# EAGLE schematic LinuxBoard_v1.0 (EAGLE 7.1.0)
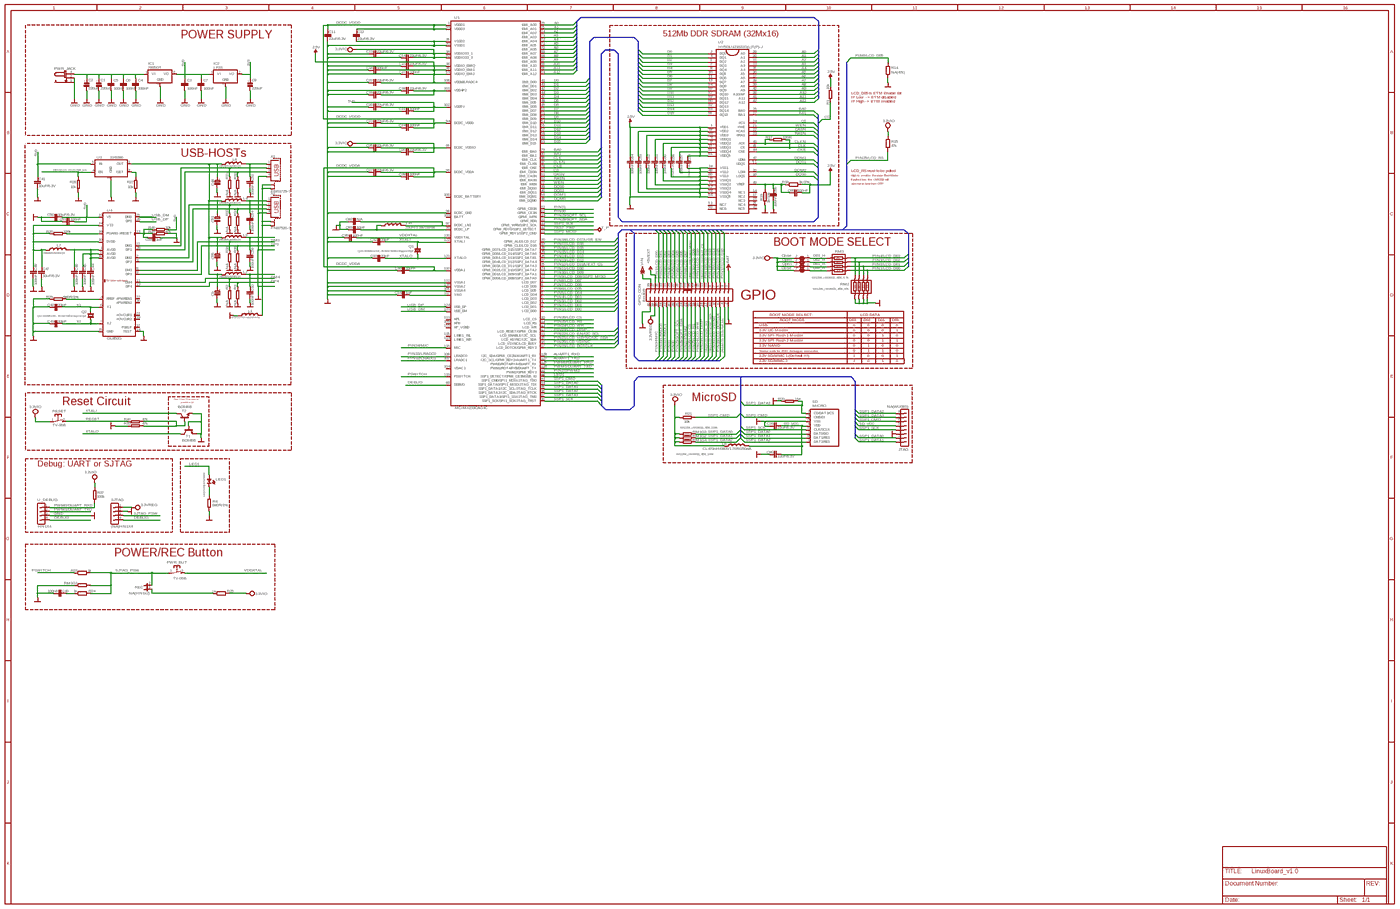
[diagram p0: schematic, sheet 1, overview]
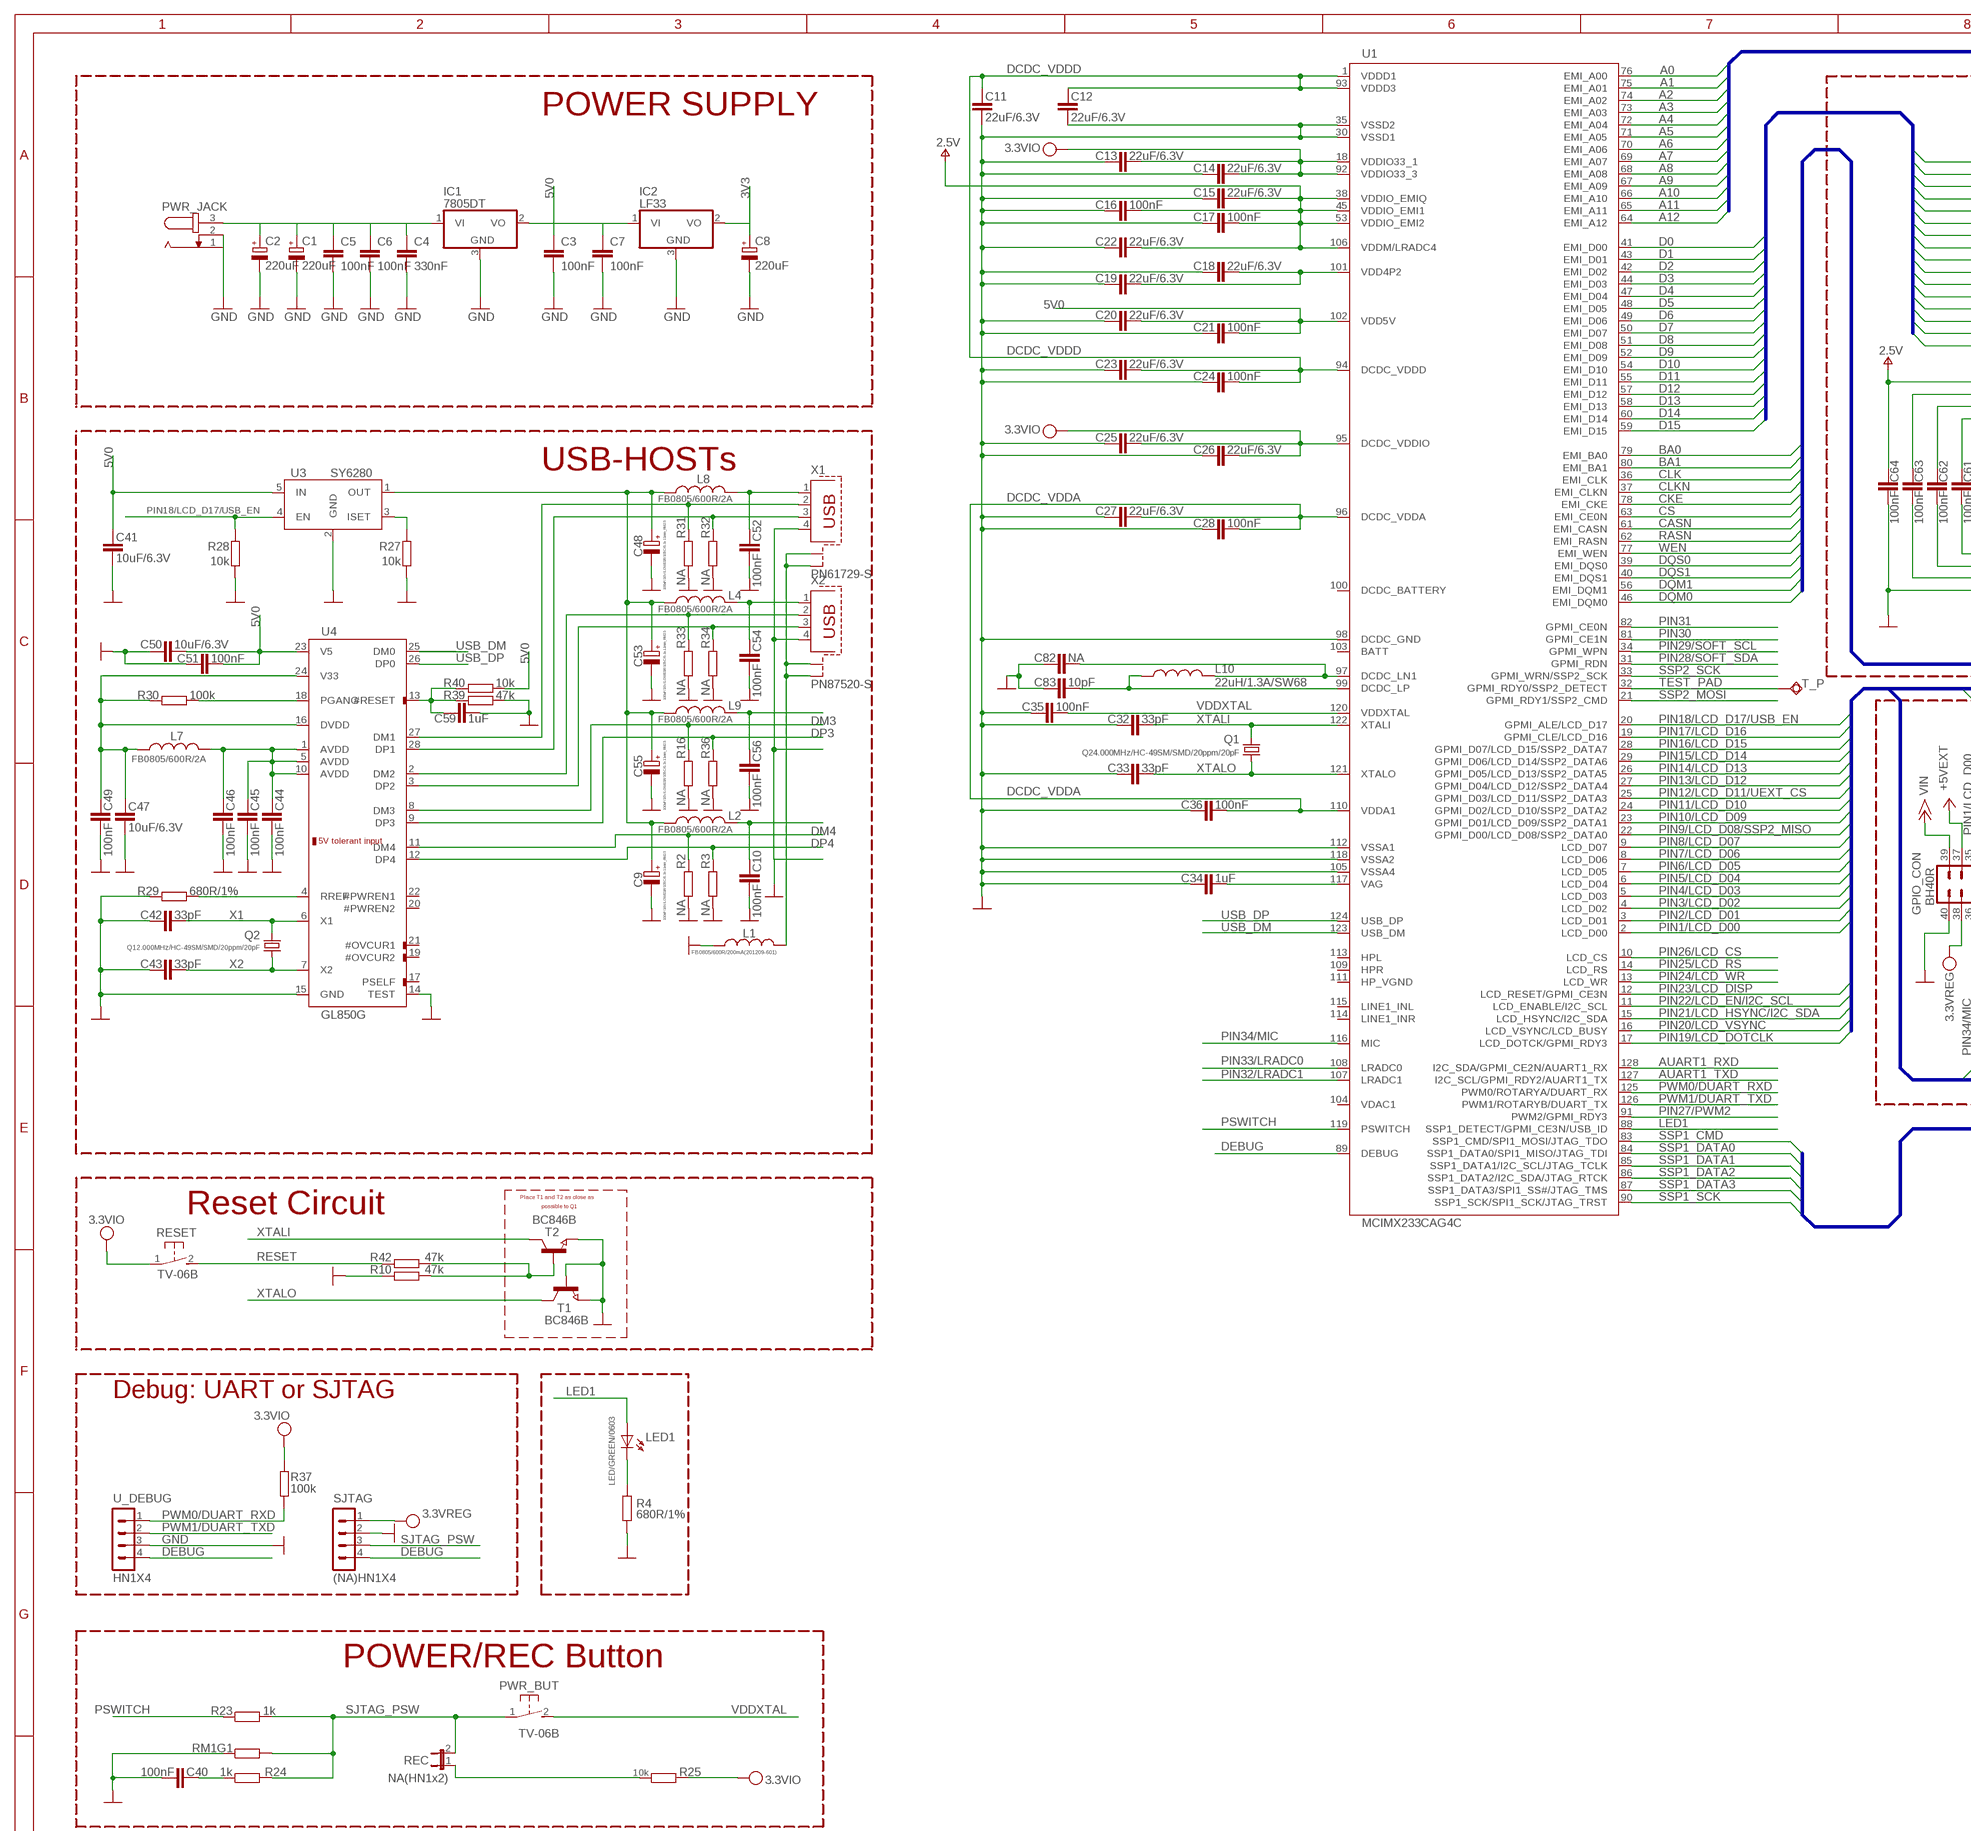
[diagram p1: schematic, sheet 1, part 1 of 4]
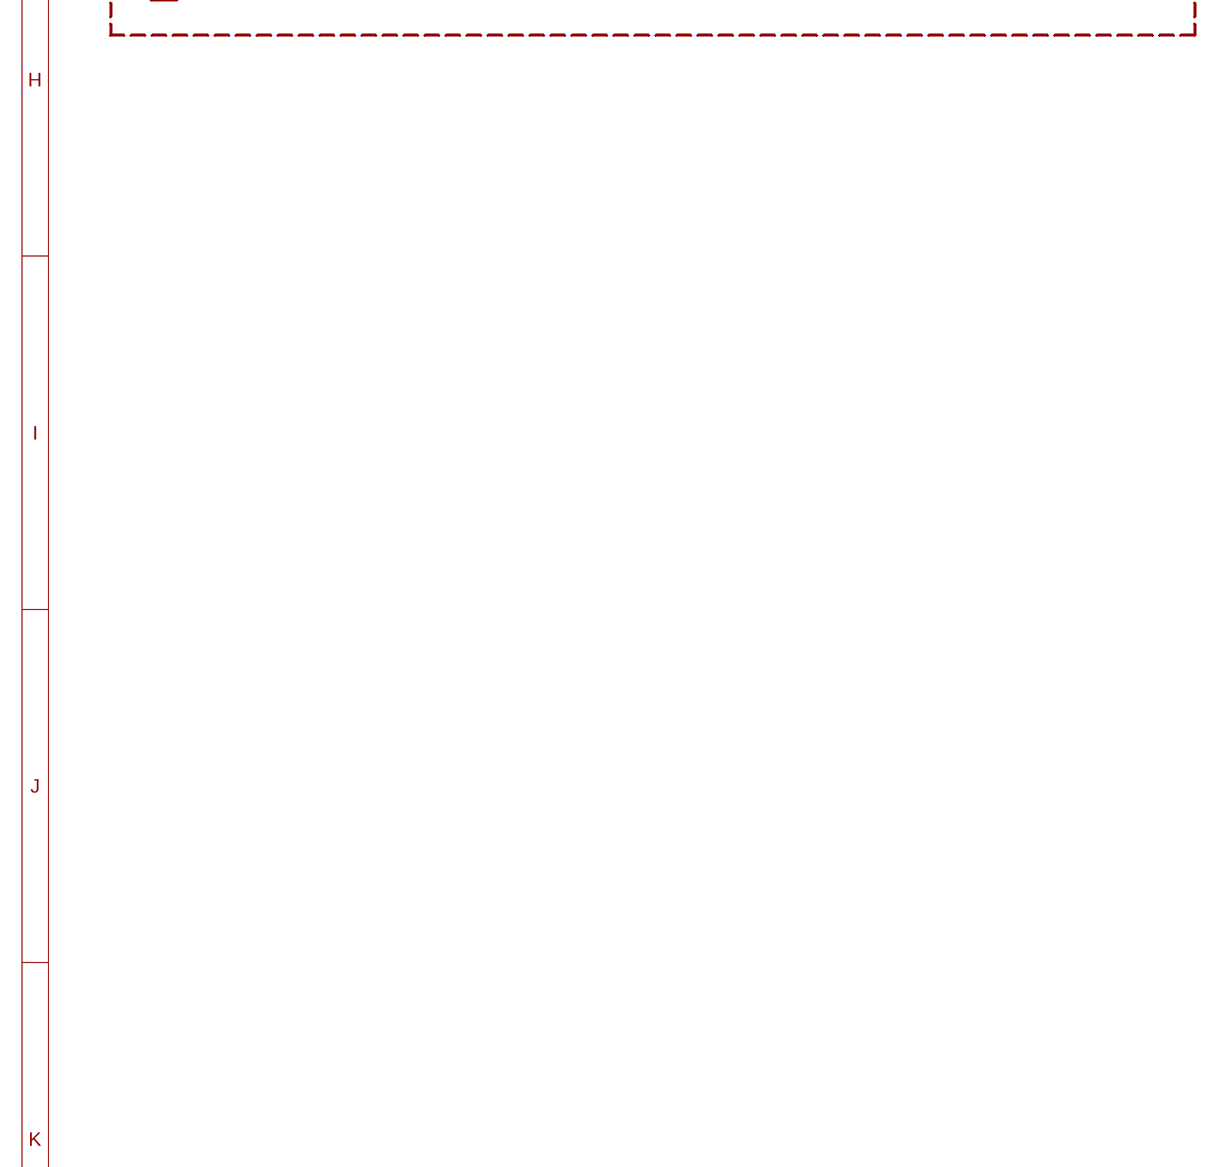
[diagram p2: schematic, sheet 1, part 2 of 4]
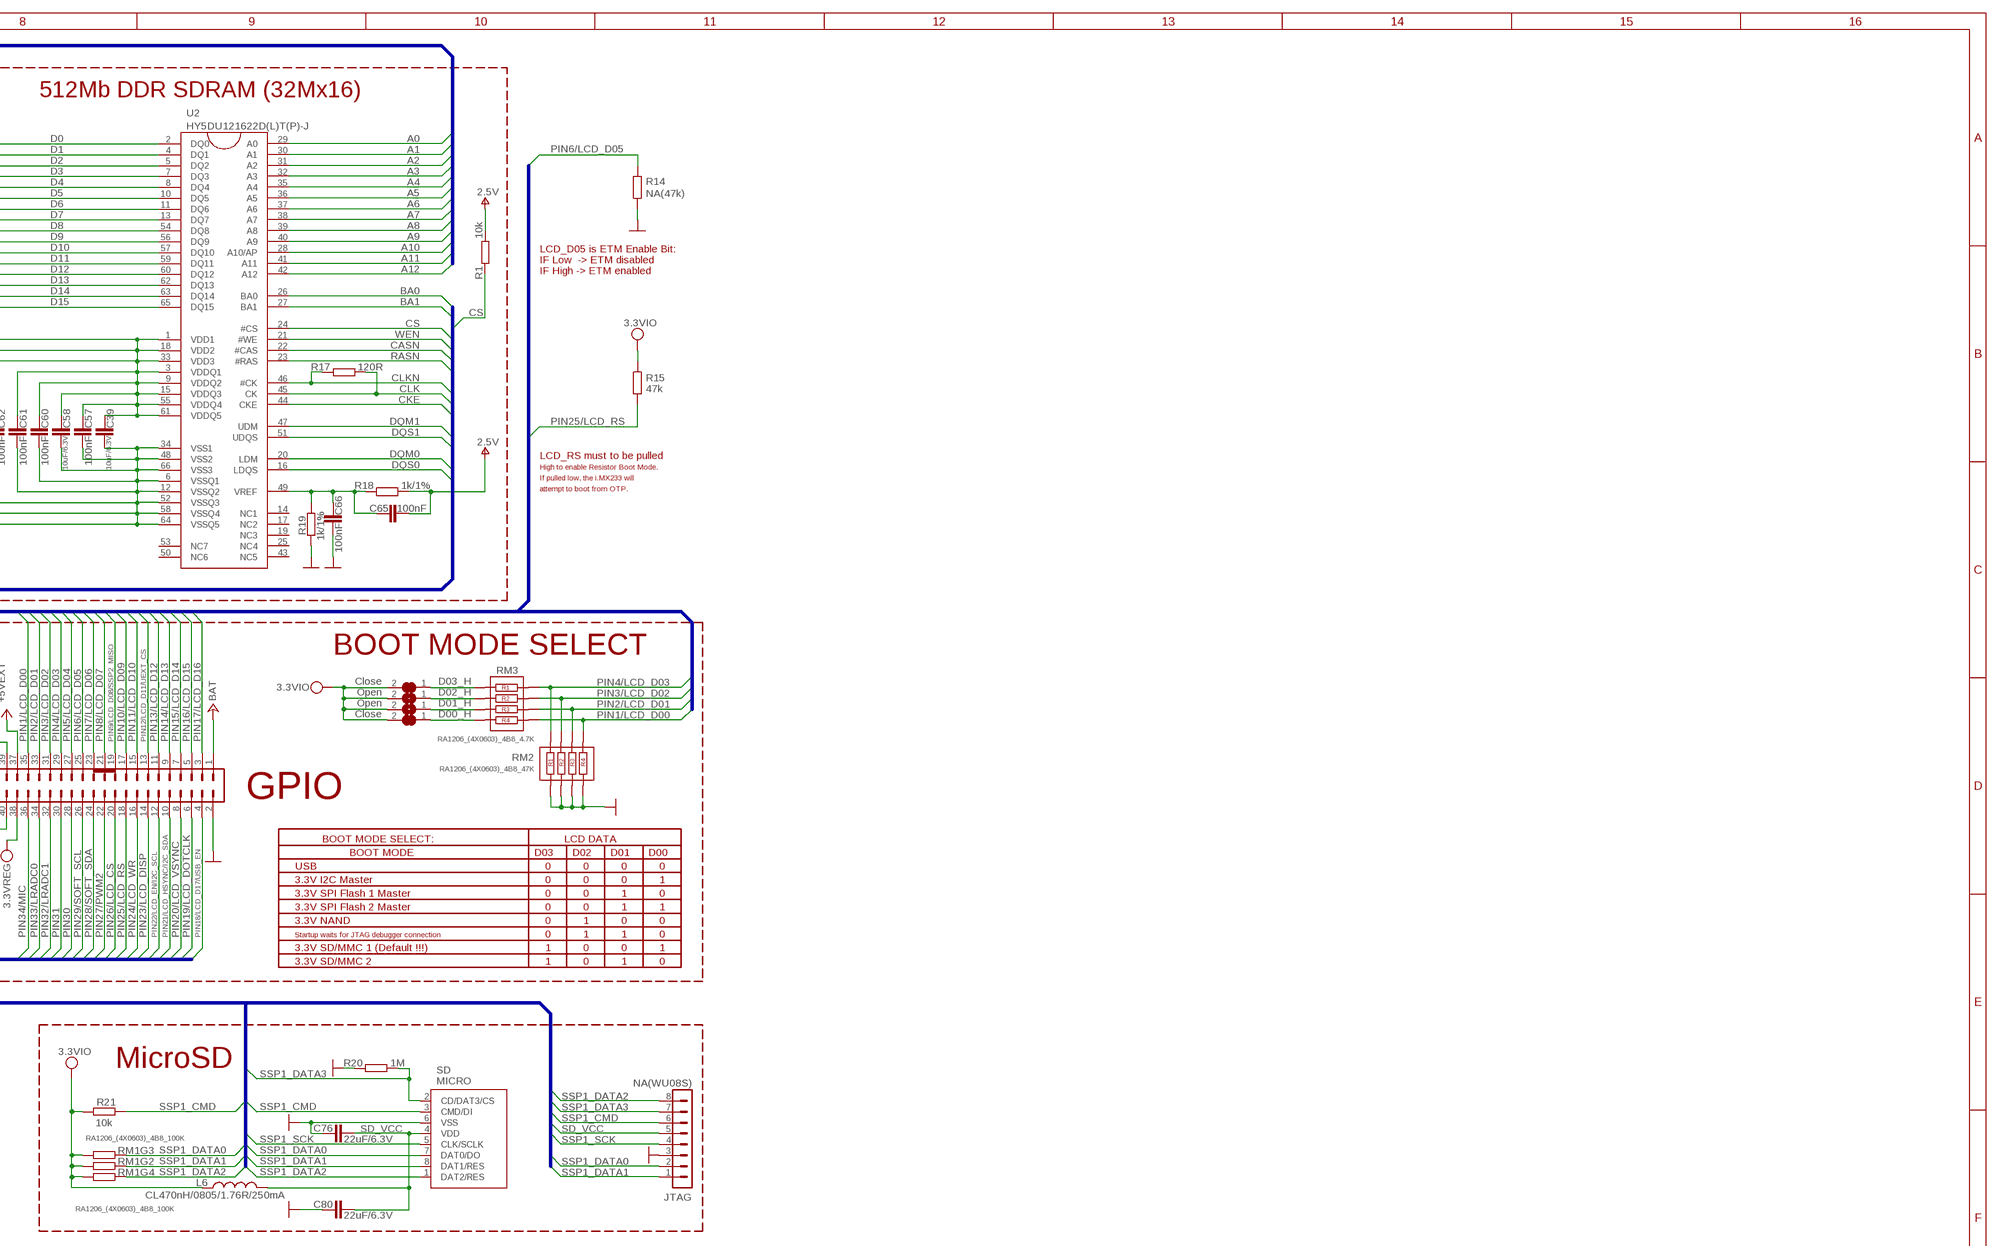
[diagram p3: schematic, sheet 1, part 3 of 4]
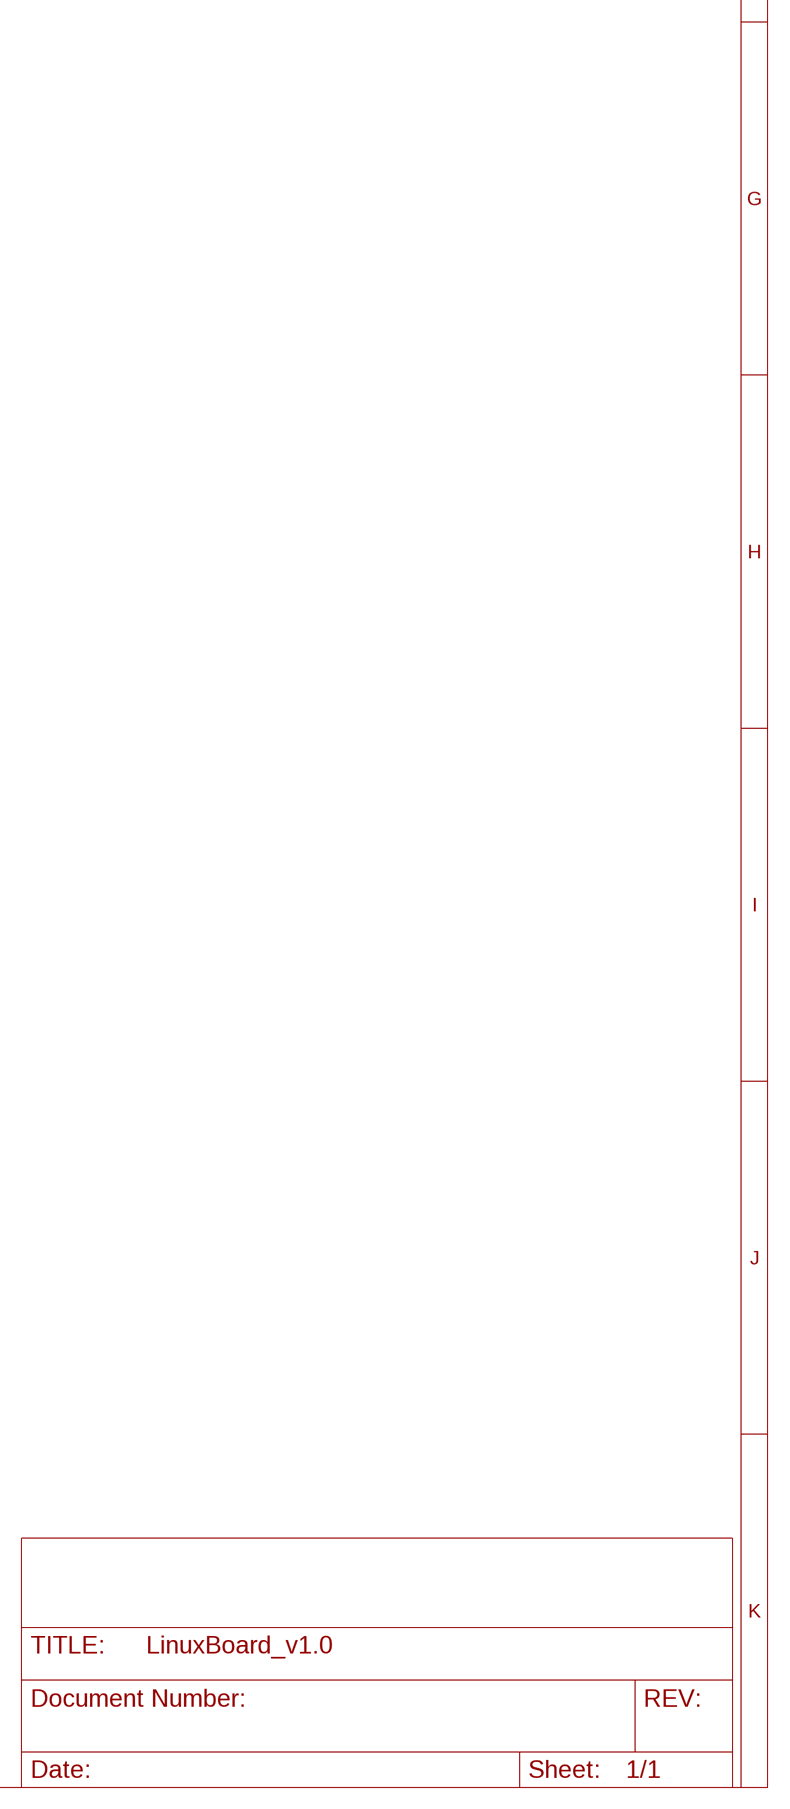
[diagram p4: schematic, sheet 1, part 4 of 4]

## Parts
C1  220uF  CPOL-EUE2-5  [E2-5]
C2  220uF  CPOL-EUE2-5  [E2-5]
C3  100nF  C-EUC0805  [C0805]
C4  330nF  C-EUC0805  [C0805]
C5  100nF  C-EUC0805  [C0805]
C6  100nF  C-EUC0805  [C0805]
C7  100nF  C-EUC0805  [C0805]
C8  220uF  CPOL-EUE2-5  [E2-5]
C9  100uF/16V/LOWESR/105C/6.3x11mm_RM2.5  CPOL-EUE2.5-6.3  [E2,5-6,3]
C10  100nF  C-EUC0603_DWS  [C0603_DWS]
C11  22uF/6.3V  C-EUC0805_5MIL_DWS  [C0805_5MIL_DWS]
C12  22uF/6.3V  C-EUC0805_5MIL_DWS  [C0805_5MIL_DWS]
C13  22uF/6.3V  C-EUC0805_5MIL_DWS  [C0805_5MIL_DWS]
C14  22uF/6.3V  C-EUC0805_5MIL_DWS  [C0805_5MIL_DWS]
C15  22uF/6.3V  C-EUC0805_5MIL_DWS  [C0805_5MIL_DWS]
C16  100nF  C-EUC0603_DWS  [C0603_DWS]
C17  100nF  C-EUC0603_DWS  [C0603_DWS]
C18  22uF/6.3V  C-EUC0805_5MIL_DWS  [C0805_5MIL_DWS]
C19  22uF/6.3V  C-EUC0805_5MIL_DWS  [C0805_5MIL_DWS]
C20  22uF/6.3V  C-EUC0805_5MIL_DWS  [C0805_5MIL_DWS]
C21  100nF  C-EUC0603_DWS  [C0603_DWS]
C22  22uF/6.3V  C-EUC0805_5MIL_DWS  [C0805_5MIL_DWS]
C23  22uF/6.3V  C-EUC0805_5MIL_DWS  [C0805_5MIL_DWS]
C24  100nF  C-EUC0603_DWS  [C0603_DWS]
C25  22uF/6.3V  C-EUC0805_5MIL_DWS  [C0805_5MIL_DWS]
C26  22uF/6.3V  C-EUC0805_5MIL_DWS  [C0805_5MIL_DWS]
C27  22uF/6.3V  C-EUC0805_5MIL_DWS  [C0805_5MIL_DWS]
C28  100nF  C-EUC0603_DWS  [C0603_DWS]
C32  33pF  C-EUC0603_DWS  [C0603_DWS]
C33  33pF  C-EUC0603_DWS  [C0603_DWS]
C34  1uF  C-EUC0603_DWS  [C0603_DWS]
C35  100nF  C-EUC0603_DWS  [C0603_DWS]
C36  100nF  C-EUC0603_DWS  [C0603_DWS]
C39  10uF/6.3V  C-EUC0603_DWS  [C0603_DWS]
C40  100nF  C-EUC0603_DWS  [C0603_DWS]
C41  10uF/6.3V  C-EUC0603_DWS  [C0603_DWS]
C42  33pF  C-EUC0603_DWS  [C0603_DWS]
C43  33pF  C-EUC0603_DWS  [C0603_DWS]
C44  100nF  C-EUC0603_DWS  [C0603_DWS]
C45  100nF  C-EUC0603_DWS  [C0603_DWS]
C46  100nF  C-EUC0603_DWS  [C0603_DWS]
C47  10uF/6.3V  C-EUC0603_DWS  [C0603_DWS]
C48  100uF/16V/LOWESR/105C/6.3x11mm_RM2.5  CPOL-EUE2.5-6.3  [E2,5-6,3]
C49  100nF  C-EUC0603_DWS  [C0603_DWS]
C50  10uF/6.3V  C-EUC0603_DWS  [C0603_DWS]
C51  100nF  C-EUC0603_DWS  [C0603_DWS]
C52  100nF  C-EUC0603_DWS  [C0603_DWS]
C53  100uF/16V/LOWESR/105C/6.3x11mm_RM2.5  CPOL-EUE2.5-6.3  [E2,5-6,3]
C54  100nF  C-EUC0603_DWS  [C0603_DWS]
C55  100uF/16V/LOWESR/105C/6.3x11mm_RM2.5  CPOL-EUE2.5-6.3  [E2,5-6,3]
C56  100nF  C-EUC0603_DWS  [C0603_DWS]
C57  100nF  C-EUC0603_DWS  [C0603_DWS]
C58  10uF/6.3V  C-EUC0603_DWS  [C0603_DWS]
C59  1uF  C-EUC0603_DWS  [C0603_DWS]
C60  100nF  C-EUC0603_DWS  [C0603_DWS]
C61  100nF  C-EUC0603_DWS  [C0603_DWS]
C62  100nF  C-EUC0603_DWS  [C0603_DWS]
C63  100nF  C-EUC0603_DWS  [C0603_DWS]
C64  100nF  C-EUC0603_DWS  [C0603_DWS]
C65  100nF  C-EUC0603_DWS  [C0603_DWS]
C66  100nF  C-EUC0603_DWS  [C0603_DWS]
C76  22uF/6.3V  C-EUC0805_5MIL_DWS  [C0805_5MIL_DWS]
C80  22uF/6.3V  C-EUC0805_5MIL_DWS  [C0805_5MIL_DWS]
C82  NA  C-EUC0603_DWS  [C0603_DWS]
C83  10pF  C-EUC0603_DWS  [C0603_DWS]
D00_H  Close  SJSJ_SMALLER  [SJ_1_SMALLER]
D01_H  Open  SJSJ_SMALLER  [SJ_1_SMALLER]
D02_H  Open  SJSJ_SMALLER  [SJ_1_SMALLER]
D03_H  Close  SJSJ_SMALLER  [SJ_1_SMALLER]
GPIO_CON  BH40R  ML40R  [BH40R]
IC1  7805DT  [TO252]
IC2  LF33  7805DT  [TO252]
JTAG  NA(WU08S)  CON8WU08S  [WU08S]
L1  FB0805/600R/200mA(201209-601)  L-USL0805_5MIL_DWS  [L0805_5MIL_DWS]
L2  FB0805/600R/2A  L-USL0805_5MIL_DWS  [L0805_5MIL_DWS]
L4  FB0805/600R/2A  L-USL0805_5MIL_DWS  [L0805_5MIL_DWS]
L6  CL470nH/0805/1.76R/250mA  L-USL0805_5MIL_DWS  [L0805_5MIL_DWS]
L7  FB0805/600R/2A  L-USL0805_5MIL_DWS  [L0805_5MIL_DWS]
L8  FB0805/600R/2A  L-USL0805_5MIL_DWS  [L0805_5MIL_DWS]
L9  FB0805/600R/2A  L-USL0805_5MIL_DWS  [L0805_5MIL_DWS]
L10  22uH/1.3A/SW68  L-USL_CD53  [CD53]
LED1  LED/GREEN/0603  LED0603DWS  [LED-0603]
PWR_BUT  TV-06B  31-XX  [B3F-31XX]
PWR_JACK  JACK-PLUG0  [SPC4077]
Q1  Q24.000MHz/HC-49SM/SMD/20ppm/20pF  HC49/S1  [HC49/SMD2_THIN]
Q2  Q12.000MHz/HC-49SM/SMD/20ppm/20pF  HC49/S1  [HC49/SMD2_THIN]
R1  10k  R-EU_R0603_5MIL_DWS  [R0603_5MIL_DWS]
R2  NA  R-EU_R0603_5MIL_DWS  [R0603_5MIL_DWS]
R3  NA  R-EU_R0603_5MIL_DWS  [R0603_5MIL_DWS]
R4  680R/1%  R-EU_R0603_5MIL_DWS  [R0603_5MIL_DWS]
R10  47k  R-EU_R0603_5MIL_DWS  [R0603_5MIL_DWS]
R14  NA(47k)  R-EU_R0603_5MIL_DWS  [R0603_5MIL_DWS]
R15  47k  R-EU_R0603_5MIL_DWS  [R0603_5MIL_DWS]
R16  NA  R-EU_R0603_5MIL_DWS  [R0603_5MIL_DWS]
R17  120R  R-EU_R0603_5MIL_DWS  [R0603_5MIL_DWS]
R18  1k/1%  R-EU_R0603_5MIL_DWS  [R0603_5MIL_DWS]
R19  1k/1%  R-EU_R0603_5MIL_DWS  [R0603_5MIL_DWS]
R20  1M  R-EU_R0603_5MIL_DWS  [R0603_5MIL_DWS]
R21  10k  R-EU_R0603_5MIL_DWS  [R0603_5MIL_DWS]
R23  1k  R-EU_R0603_5MIL_DWS  [R0603_5MIL_DWS]
R24  1k  R-EU_R0603_5MIL_DWS  [R0603_5MIL_DWS]
R25  10k  R-EU_R0603_5MIL_DWS_NA  [R0603_5MIL_DWS_NA]
R27  10k  R-EU_R0603_5MIL_DWS  [R0603_5MIL_DWS]
R28  10k  R-EU_R0603_5MIL_DWS  [R0603_5MIL_DWS]
R29  680R/1%  R-EU_R0603_5MIL_DWS  [R0603_5MIL_DWS]
R30  100k  R-EU_R0603_5MIL_DWS  [R0603_5MIL_DWS]
R31  NA  R-EU_R0603_5MIL_DWS  [R0603_5MIL_DWS]
R32  NA  R-EU_R0603_5MIL_DWS  [R0603_5MIL_DWS]
R33  NA  R-EU_R0603_5MIL_DWS  [R0603_5MIL_DWS]
R34  NA  R-EU_R0603_5MIL_DWS  [R0603_5MIL_DWS]
R36  NA  R-EU_R0603_5MIL_DWS  [R0603_5MIL_DWS]
R37  100k  R-EU_R0603_5MIL_DWS  [R0603_5MIL_DWS]
R39  47k  R-EU_R0603_5MIL_DWS  [R0603_5MIL_DWS]
R40  10k  R-EU_R0603_5MIL_DWS  [R0603_5MIL_DWS]
R42  47k  R-EU_R0603_5MIL_DWS  [R0603_5MIL_DWS]
REC  NA(HN1x2)  JP1E  [JP1]
RESET  TV-06B  31-XX  [B3F-31XX]
RM1  RA1206_(4X0603)_4B8_100K  R_MATRIX_4E  [R_MATRIX_4]
RM2  RA1206_(4X0603)_4B8_47K  R_MATRIX_4  [R_MATRIX_4]
RM3  RA1206_(4X0603)_4B8_4.7K  R_MATRIX_4  [R_MATRIX_4]
SD  MICRO  MICRO_SD/MMC  [TFR-MEM-CON]
SJTAG  (NA)HN1X4  CON4HN1X4  [HN1X4]
T1  BC846B  NPN-TRANSISTOR_SOT23  [SOT23]
T2  BC846B  NPN-TRANSISTOR_SOT23  [SOT23]
T_P  TESTPAD50/40  [SMD50/40]
U1  MCIMX233CAG4C  MCIMX233DAG4B_LD  [TQFP128LD]
U2  HY5DU121622D(L)T(P)-J  [66TSOP-II]
U3  SY6280  [SOT23-5]
U4  GL850G  [SSOP28]
U_DEBUG  HN1X4  CON4HN1X4  [HN1X4]
X1  PN61729-S  [PN61729-S]
X2  PN87520-S  [PN87520-S]

## Nets
3V3: C8.+ IC2.2(VO)
5V0: C3.1 C7.1 C20.2 C21.2 C41.1 C50.1 C51.1 IC1.2(VO) IC2.1(VI) R40.2 U1.102(VDD5V) U3.5(IN) U4.23(V5)
+5V: GPIO_CON.37 ; supply symbol labelled +5VEXT
+15V: GPIO_CON.39 ; supply symbol labelled VIN
+24V: GPIO_CON.1 ; supply symbol labelled BAT
A0: U1.76(EMI_A00) U2.29(A0)
A1: U1.75(EMI_A01) U2.30(A1)
A2: U1.74(EMI_A02) U2.31(A2)
A3: U1.73(EMI_A03) U2.32(A3)
A4: U1.72(EMI_A04) U2.35(A4)
A5: U1.71(EMI_A05) U2.36(A5)
A6: U1.70(EMI_A06) U2.37(A6)
A7: U1.69(EMI_A07) U2.38(A7)
A8: U1.68(EMI_A08) U2.39(A8)
A9: U1.67(EMI_A09) U2.40(A9)
A10: U1.66(EMI_A10) U2.28(A10/AP)
A11: U1.65(EMI_A11) U2.41(A11)
A12: U1.64(EMI_A12) U2.42(A12)
AUART1_RXD: U1.128(I2C_SDA/GPMI_CE2N/AUART1_RX)
AUART1_TXD: U1.127(I2C_SCL/GPMI_RDY2/AUART1_TX)
BA0: U1.79(EMI_BA0) U2.26(BA0)
BA1: U1.80(EMI_BA1) U2.27(BA1)
CASN: U1.61(EMI_CASN) U2.22(#CAS)
CKE: U1.78(EMI_CKE) U2.44(CKE)
CLK: R17.2 U1.36(EMI_CLK) U2.45(CK)
CLKN: R17.1 U1.37(EMI_CLKN) U2.46(#CK)
CS: R1.1 U1.63(EMI_CE0N) U2.24(#CS)
D0: U1.41(EMI_D00) U2.2(DQ0)
D1: U1.43(EMI_D01) U2.4(DQ1)
D2: U1.42(EMI_D02) U2.5(DQ2)
D3: U1.44(EMI_D03) U2.7(DQ3)
D4: U1.47(EMI_D04) U2.8(DQ4)
D5: U1.48(EMI_D05) U2.10(DQ5)
D6: U1.49(EMI_D06) U2.11(DQ6)
D7: U1.50(EMI_D07) U2.13(DQ7)
D8: U1.51(EMI_D08) U2.54(DQ8)
D9: U1.52(EMI_D09) U2.56(DQ9)
D10: U1.54(EMI_D10) U2.57(DQ10)
D11: U1.55(EMI_D11) U2.59(DQ11)
D12: U1.57(EMI_D12) U2.60(DQ12)
D13: U1.58(EMI_D13) U2.62(DQ13)
D14: U1.60(EMI_D14) U2.63(DQ14)
D15: U1.59(EMI_D15) U2.65(DQ15)
DCDC_VDDA: C27.2 C28.2 C36.2 U1.96(DCDC_VDDA) U1.110(VDDA1)
DCDC_VDDD: C11.2 C12.2 C23.2 C24.2 U1.1(VDDD1) U1.93(VDDD3) U1.94(DCDC_VDDD)
DEBUG: SJTAG.4 U1.89(DEBUG) U_DEBUG.4
DM3: R16.2 U4.8(DM3)
DM4: R2.2 U4.11(DM4)
DP3: R36.2 U4.9(DP3)
DP4: R3.2 U4.12(DP4)
DQM0: U1.46(EMI_DQM0) U2.20(LDM)
DQM1: U1.56(EMI_DQM1) U2.47(UDM)
DQS0: U1.39(EMI_DQS0) U2.16(LDQS)
DQS1: U1.40(EMI_DQS1) U2.51(UDQS)
GND: C1.- C2.- C3.2 C4.2 C5.2 C6.2 C7.2 C8.- C9.- C10.2 C11.1 C12.1 C13.1 C14.1 C15.1 C16.1 C17.1 C18.1 C19.1 C20.1 C21.1 C22.1 C23.1 C24.1 C25.1 C26.1 C27.1 C28.1 C32.1 C33.1 C34.1 C35.1 C36.1 C39.1 C40.2 C41.2 C42.1 C43.1 C44.2 C45.2 C46.2 C47.2 C48.- C49.2 C50.2 C51.2 C52.2 C53.- C54.2 C55.- C56.2 C57.1 C58.1 C59.1 C60.1 C61.1 C62.1 C63.1 C64.1 C66.1 C76.1 C80.1 C82.1 C83.1 GPIO_CON.2 GPIO_CON.40 IC1.3(GND) IC2.3(GND) JTAG.3 L1.1 PWR_JACK.1 PWR_JACK.2 R2.1 R3.1 R4.1 R10.2 R14.1 R16.1 R19.1 R20.2 R27.1 R28.1 R29.1 R31.1 R32.1 R33.1 R34.1 R36.1 R39.2 RM1.1.1 RM2.1.1 RM2.2.1 RM2.3.1 RM2.4.1 SD.6(VSS) SJTAG.2 T1.1(B) T1.2(E) T2.2(E) U1.30(VSSD1) U1.35(VSSD2) U1.98(DCDC_GND) U1.105(VSSA4) U1.112(VSSA1) U1.118(VSSA2) U2.6(VSSQ1) U2.12(VSSQ2) U2.34(VSS1) U2.48(VSS2) U2.52(VSSQ3) U2.58(VSSQ4) U2.64(VSSQ5) U2.66(VSS3) U3.2(GND) U4.14(TEST) U4.15(GND) U_DEBUG.3 X1.4 X2.4
LED1 [pwr]: LED1.A U1.88(SSP1_DETECT/GPMI_CE3N/USB_ID)
N$1: R27.2 U3.3(ISET)
N$2: R29.2 U4.4(RREF)
N$3: R30.2 U4.18(PGANG)
N$5: C59.2 R39.1 R40.1 U4.13(#RESET)
N$6: C10.1 L2.2
N$7: C9.+ C48.+ C53.+ C55.+ L2.1 L4.1 L8.1 L9.1 U3.1(OUT)
N$9: R31.2 U4.27(DM1) X1.2
N$10: C44.1 C45.1 C46.1 L7.2 U4.1(AVDD) U4.5(AVDD) U4.10(AVDD)
N$11: C47.1 C49.1 L7.1 R30.1 U4.16(DVDD) U4.24(V33)
N$12: R32.2 U4.28(DP1) X1.3
N$13: R33.2 U4.2(DM2) X2.2
N$14: R34.2 U4.3(DP2) X2.3
N$16: L1.2 X1.S1 X1.S2 X2.S1 X2.S2
N$17: C65.2 C66.2 R18.1 R19.2 U2.49(VREF)
N$18: C82.2 L10.2 U1.97(DCDC_LN1)
N$19: C83.2 L10.1 U1.99(DCDC_LP)
N$20: C52.1 L8.2 X1.1
N$24: C54.1 L4.2 X2.1
N$25: C34.2 U1.117(VAG)
N$27: C56.1 L9.2
N$38: C40.1 R24.1
N$39: R25.1 REC.1
N$42: LED1.C R4.2
N$43: R10.1 R42.1 T2.1(B)
N$101: D03_H.1 RM3.1.2
N$103: D02_H.1 RM3.2.2
N$104: D01_H.1 RM3.3.2
N$105: D00_H.1 RM3.4.2
PIN1/LCD_D00: GPIO_CON.35 RM2.4.2 RM3.4.1 U1.2(LCD_D00)
PIN2/LCD_D01: GPIO_CON.33 RM2.3.2 RM3.3.1 U1.3(LCD_D01)
PIN3/LCD_D02: GPIO_CON.31 RM2.2.2 RM3.2.1 U1.4(LCD_D02)
PIN4/LCD_D03: GPIO_CON.29 RM2.1.2 RM3.1.1 U1.5(LCD_D03)
PIN5/LCD_D04: GPIO_CON.27 U1.6(LCD_D04)
PIN6/LCD_D05: GPIO_CON.25 R14.2 U1.7(LCD_D05)
PIN7/LCD_D06: GPIO_CON.23 U1.8(LCD_D06)
PIN8/LCD_D07: GPIO_CON.21 U1.9(LCD_D07)
PIN9/LCD_D08/SSP2_MISO: GPIO_CON.19 U1.22(GPMI_D00/LCD_D08/SSP2_DATA0)
PIN10/LCD_D09: GPIO_CON.17 U1.23(GPMI_D01/LCD_D09/SSP2_DATA1)
PIN11/LCD_D10: GPIO_CON.15 U1.24(GPMI_D02/LCD_D10/SSP2_DATA2)
PIN12/LCD_D11/UEXT_CS: GPIO_CON.13 U1.25(GPMI_D03/LCD_D11/SSP2_DATA3)
PIN13/LCD_D12: GPIO_CON.11 U1.27(GPMI_D04/LCD_D12/SSP2_DATA4)
PIN14/LCD_D13: GPIO_CON.9 U1.26(GPMI_D05/LCD_D13/SSP2_DATA5)
PIN15/LCD_D14: GPIO_CON.7 U1.29(GPMI_D06/LCD_D14/SSP2_DATA6)
PIN16/LCD_D15: GPIO_CON.5 U1.28(GPMI_D07/LCD_D15/SSP2_DATA7)
PIN17/LCD_D16: GPIO_CON.3 U1.19(GPMI_CLE/LCD_D16)
PIN18/LCD_D17/USB_EN: GPIO_CON.4 R28.2 U1.20(GPMI_ALE/LCD_D17) U3.4(EN)
PIN19/LCD_DOTCLK: GPIO_CON.6 U1.17(LCD_DOTCK/GPMI_RDY3)
PIN20/LCD_VSYNC: GPIO_CON.8 U1.16(LCD_VSYNC/LCD_BUSY)
PIN21/LCD_HSYNC/I2C_SDA: GPIO_CON.10 U1.15(LCD_HSYNC/I2C_SDA)
PIN22/LCD_EN/I2C_SCL: GPIO_CON.12 U1.11(LCD_ENABLE/I2C_SCL)
PIN23/LCD_DISP: GPIO_CON.14 U1.12(LCD_RESET/GPMI_CE3N)
PIN24/LCD_WR: GPIO_CON.16 U1.13(LCD_WR)
PIN25/LCD_RS: GPIO_CON.18 R15.2 U1.14(LCD_RS)
PIN26/LCD_CS: GPIO_CON.20 U1.10(LCD_CS)
PIN27/PWM2 [pwr]: GPIO_CON.22 U1.91(PWM2/GPMI_RDY3)
PIN28/SOFT_SDA: GPIO_CON.24 U1.31(GPMI_RDN)
PIN29/SOFT_SCL: GPIO_CON.26 U1.34(GPMI_WPN)
PIN30: GPIO_CON.28 U1.81(GPMI_CE1N)
PIN31: GPIO_CON.30 U1.82(GPMI_CE0N)
PIN32/LRADC1: GPIO_CON.32 U1.107(LRADC1)
PIN33/LRADC0: GPIO_CON.34 U1.108(LRADC0)
PIN34/MIC: GPIO_CON.36 U1.116(MIC)
PSWITCH: R23.1 U1.119(PSWITCH)
PWM0/DUART_RXD: R37.1 U1.125(PWM0/ROTARYA/DUART_RX) U_DEBUG.1
PWM1/DUART_TXD: U1.126(PWM1/ROTARYB/DUART_TX) U_DEBUG.2
RASN: U1.62(EMI_RASN) U2.23(#RAS)
RESET: R42.2 RESET.2(S)
SD_VCC: C76.2 C80.2 JTAG.5 L6.2 SD.4(VDD)
SJTAG_PSW: PWR_BUT.1(P) R23.2 R24.2 REC.2 RM1.1.2 SJTAG.3
SSP1_CMD: JTAG.6 R21.1 SD.3(CMD/DI) U1.83(SSP1_CMD/SPI1_MOSI/JTAG_TDO)
SSP1_DATA0: JTAG.2 RM1.3.1 SD.7(DAT0/DO) U1.84(SSP1_DATA0/SPI1_MISO/JTAG_TDI)
SSP1_DATA1: JTAG.1 RM1.2.1 SD.8(DAT1/RES) U1.85(SSP1_DATA1/I2C_SCL/JTAG_TCLK)
SSP1_DATA2: JTAG.8 RM1.4.1 SD.1(DAT2/RES) U1.86(SSP1_DATA2/I2C_SDA/JTAG_RTCK)
SSP1_DATA3: JTAG.7 R20.1 SD.2(CD/DAT3/CS) U1.87(SSP1_DATA3/SPI1_SS#/JTAG_TMS)
SSP1_SCK: JTAG.4 SD.5(CLK/SCLK) U1.90(SSP1_SCK/SPI1_SCK/JTAG_TRST)
SSP2_MOSI: U1.21(GPMI_RDY1/SSP2_CMD)
SSP2_SCK: U1.33(GPMI_WRN/SSP2_SCK)
TEST_PAD: T_P.P$1(PP) U1.32(GPMI_RDY0/SSP2_DETECT)
USB_DM: U1.123(USB_DM) U4.25(DM0)
USB_DP: U1.124(USB_DP) U4.26(DP0)
V+: C15.2 C16.2 C17.2 C22.2 C39.2 C57.2 C58.2 C60.2 C61.2 C62.2 C63.2 C64.2 C65.1 R1.2 R18.2 U1.38(VDDIO_EMIQ) U1.45(VDDIO_EMI1) U1.53(VDDIO_EMI2) U1.106(VDDM/LRADC4) U2.1(VDD1) U2.3(VDDQ1) U2.9(VDDQ2) U2.15(VDDQ3) U2.18(VDD2) U2.33(VDD3) U2.55(VDDQ4) U2.61(VDDQ5) ; supply symbol labelled 2.5V
VCC [pwr]: GPIO_CON.38 SJTAG.1 ; supply symbol labelled 3.3VREG
VDD4P2: C18.2 C19.2 U1.101(VDD4P2)
VDDXTAL: C35.2 PWR_BUT.2(S) U1.120(VDDXTAL)
VIN_JACK: C1.+ C2.+ C4.1 C5.1 C6.1 IC1.1(VI) PWR_JACK.3
VPP [pwr]: C13.2 C14.2 C25.2 C26.2 D00_H.2 D01_H.2 D02_H.2 D03_H.2 L6.1 R15.1 R21.2 R25.2 R37.2 RESET.1(P) RM1.2.2 RM1.3.2 RM1.4.2 U1.18(VDDIO33_1) U1.92(VDDIO33_3) U1.95(DCDC_VDDIO) ; supply symbol labelled 3.3VIO
WEN: U1.77(EMI_WEN) U2.21(#WE)
X1: C42.2 Q2.2 U4.6(X1)
X2: C43.2 Q2.1 U4.7(X2)
XTALI: C32.2 Q1.2 T2.3(C) U1.122(XTALI)
XTALO: C33.2 Q1.1 T1.3(C) U1.121(XTALO)
Unconnected: U1.103(BATT) U1.104(VDAC1) U1.109(HPR) U1.113(HPL) U1.114(LINE1_INR) U1.115(LINE1_INL) U2.14(NC1) U2.17(NC2) U2.19(NC3) U2.25(NC4) U2.43(NC5) U2.50(NC6) U2.53(NC7) U4.17(PSELF) U4.19(#OVCUR2) U4.20(#PWREN2) U4.21(#OVCUR1) U4.22(#PWREN1)

## Buses
A[0..12]
D[0..15]
SSP1_CMD/SPI1_MOSI,SSP1_DATA0/SPI1_MISO,SSP1_SCK/SPI1_SCK,SSP1_DATA3/SPI1_SS#,SSP1_DATA1/I2C_SCL,SSP1_DATA2/I2C_SDA
LCD_D17,LCD_D16,LCD_D15,LCD_D14,LCD_D13,LCD_D12,LCD_D11,LCD_D10,LCD_D09,LCD_D08/SSP2_MISO,LCD_D07,LCD_D06,LCD_D05,LCD_D04,LCD_D03,LCD_D02,LCD_D01,LCD_D00,LCD_DOTCLK,LCD_VSYNC,LCD_HSYNC/I2C_SDA,LCD_EN/I2C_SCL,LCD_DISP
BA[0..1],CLK,CLKN,CKE,CS,CASN,RASN,WEN,DQM[0..1],DQS[0..1]

## Notes on the sheet
- POWER SUPPLY | 512Mb DDR SDRAM (32Mx16)
- LCD_D05 is ETM Enable Bit:
- IF Low  -> ETM disabled
- IF High -> ETM enabled
- USB-HOSTs
- LCD_RS must to be pulled
- High to enable Resistor Boot Mode.
- If pulled low, the i.MX233 will
- attempt to boot from OTP.
- BOOT MODE SELECT
- GPIO
- BOOT MODE SELECT: | LCD DATA
- BOOT MODE | D03 | D02 | D01 | D00
- USB | 0 | 0 | 0 | 0
- 3.3V I2C Master | 0 | 0 | 0 | 1
- 3.3V SPI Flash 1 Master | 0 | 0 | 1 | 0
- 3.3V SPI Flash 2 Master | 0 | 0 | 1 | 1
- 3.3V NAND | 0 | 1 | 0 | 0
- Startup waits for JTAG debugger connection | 0 | 1 | 1 | 0
- 3.3V SD/MMC 1 (Default !!!) | 1 | 0 | 0 | 1
- 3.3V SD/MMC 2 | 1 | 0 | 1 | 0
- Place T1 and T2 as close as
- MicroSD
- possible to Q1
- Reset Circuit
- Debug: UART or SJTAG
- POWER/REC Button

## Power pins joined to a net without a drawn wire
DCDC_BATTERY: U1.100(DCDC_BATTERY)
HP_VGND: U1.111(HP_VGND)

## Library data of the parts
C1 C2 C8 C9 C48 C53 C55 = rcl:CPOL-EU: POLARIZED CAPACITOR, European symbol
C3-C7 C10-C28 C32-C36 C39-C47 C49-C52 C54 C56-C66 C76 C80 C82 C83 = rcl:C-EU: CAPACITOR, European symbol
D00_H D01_H D02_H D03_H = jumper:SJ: SMD solder JUMPER
GPIO_CON = con-harting-ml:ML40: HARTING
IC1 IC2 = linear:78*: Positive VOLTAGE REGULATOR Source: http://cache.national.com/ds/LM/LM78L05.pdf http://www.fairchildsemi.com/ds/LM/LM7805.pdf
JTAG = Penko:CON8
L1 L2 L4 L6-L10 = rcl:L-US: INDUCTOR, American symbol
LED1 = DOUBLE-SIDE:LED
PWR_BUT RESET = switch-omron:31-XX: OMRON SWITCH
PWR_JACK = con-jack:JACK-PLUG: DC POWER JACK Power Jack, DC, Right Angle, Through Hole, Rated 5A at 16VDC, PC Terminals Distributor: Farnell (www.Farnell.de) Drawing: 84N1161.pdf / 84N1162.pdf Manufacturer: SPC Technology (www.spctechnology.com) Type: SPC4077 / SPC 4078; OC_FARNELL: unknown; OC_NEWARK: unknown
Q1 Q2 = crystal:HC49/S: CRYSTAL
R1-R4 R10 R14-R21 R23-R25 R27-R34 R36 R37 R39 R40 R42 = rcl:R-EU_: RESISTOR, European symbol
REC = jumper:JP1E: JUMPER
RM1 = OLIMEX_DISCRET:R_MATRIX_4E
RM2 RM3 = OLIMEX_DISCRET:R_MATRIX_4
SD = OLIMEX_CONNECTORS:MICRO_SD/MMC
SJTAG U_DEBUG = Penko:CON4
T1 T2 = semicon-smd-ipc:NPN-TRANSISTOR_: NPN TRANSISTOR
T_P = gogo:TESTPAD: drill 40mils, diameter 70mils
U1 = OLIMEX_IC:MCIMX233DAG4B: i.MX23
U2 = OLIMEX_IC:HY5DU121622D(L)T(P)
U3 = OLIMEX_IC:SY6280
U4 = OLIMEX_IC:GL850G
X1 = con-berg:PN61729-S: BERG USB connector; OC_FARNELL: unknown; OC_NEWARK: unknown
X2 = con-berg:PN87520-S; OC_FARNELL: unknown; OC_NEWARK: unknown

## Net classes
1 pwr: width 0.5 mm, clearance 0.2 mm